# EAGLE design OSO-BILI-A1-00 (EAGLE 9.4.2)
COMPANY: ADAFRUIT INDUSTRIES; DRAWN: KTOWN; REV: B
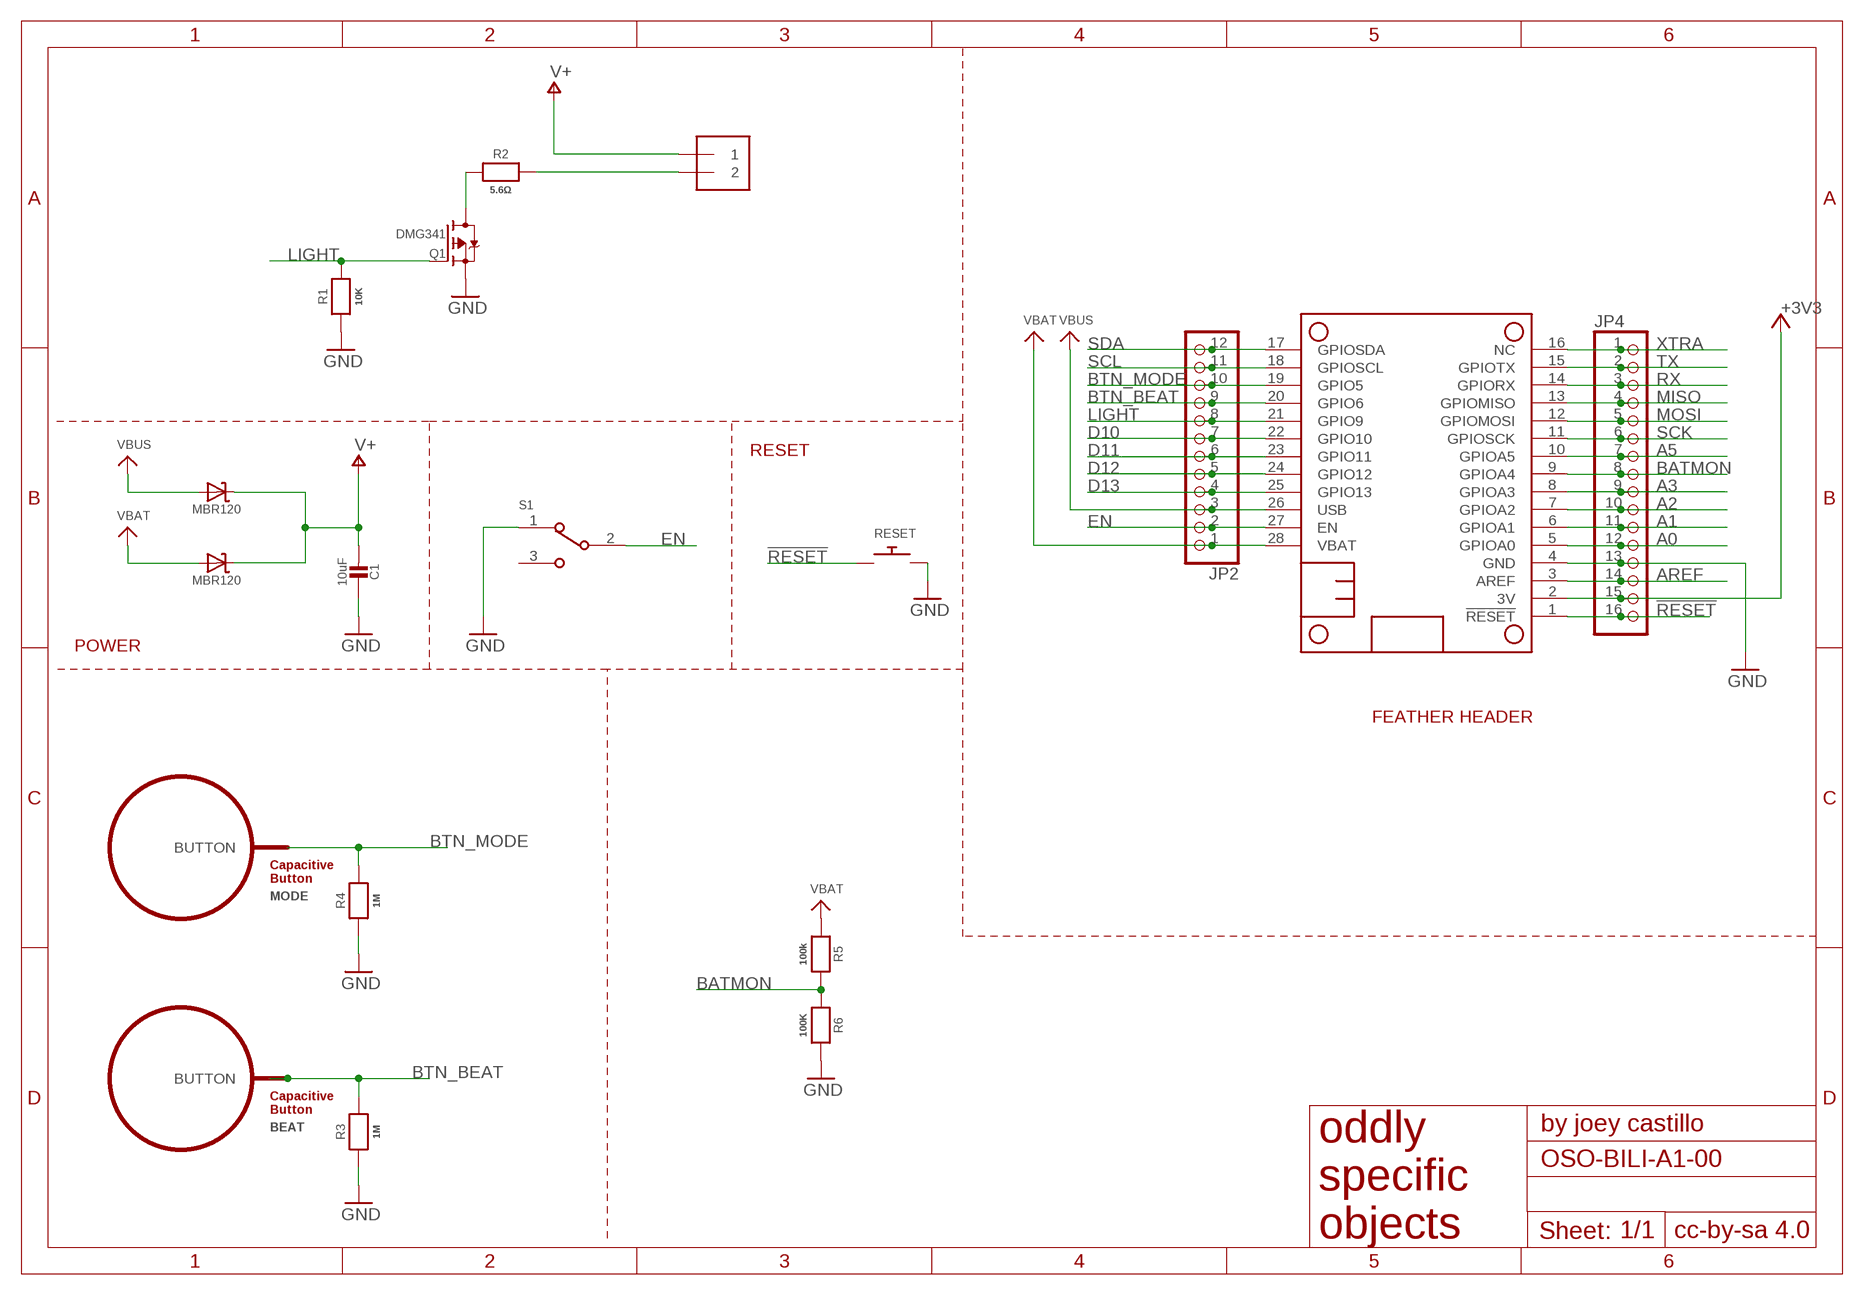
[diagram p0: schematic, sheet 1]

## Parts
BEAT  BUTTON_PASSIVE12MM  [BUTTON_PASSIVE_12MM]
C1  10uF  CAP_CERAMIC0805-NOOUTLINE  [0805-NO]
D1  MBR120  DIODE-SCHOTTKYSOD-123  [SOD-123]
D2  MBR120  DIODE-SCHOTTKYSOD-123  [SOD-123]
J1  1X25MM  [1X2-5MM]
JP2  HEADER-1X12  [1X12_ROUND]
JP4  HEADER-1X16ROUND  [1X16_ROUND]
MODE  BUTTON_PASSIVE8MM  [BUTTON_PASSIVE_8MM]
MS1  FEATHERWING  [FEATHERWING]
Q1  DMG341  MOSFET-P  [SOT23-R]
R1  10K  RESISTOR0805_NOOUTLINE  [0805-NO]
R2  5.6Ω  RESISTOR2012  [2012]
R3  1M  RESISTOR0805_NOOUTLINE  [0805-NO]
R4  1M  RESISTOR0805_NOOUTLINE  [0805-NO]
R5  100k  RESISTOR0805_10MGAP  [0805_10MGAP]
R6  100K  RESISTOR0805_NOOUTLINE  [0805-NO]
RESET  SWITCH_PUSHBUTTONC&K_KSS  [BTN_CK_KSS]
S1  JS102011SAQN  [SW_JS102011SAQN]

## Nets
3V [power]: JP4.15 MS1.2(3V) ; supply symbol labelled +3V3
!RESET: JP4.16 MS1.1(!RESET) RESET.P$1
A0: JP4.12 MS1.5(GPIOA0)
A1: JP4.11 MS1.6(GPIOA1)
A2: JP4.10 MS1.7(GPIOA2)
A3: JP4.9 MS1.8(GPIOA3)
A5: JP4.7 MS1.10(GPIOA5)
AREF: JP4.14 MS1.3(AREF)
BATMON: JP4.8 MS1.9(GPIOA4) R5.2 R6.1
BTN_BEAT: BEAT.BUTTON JP2.9 MS1.20(GPIO6) R3.2
BTN_MODE: JP2.10 MODE.BUTTON MS1.19(GPIO5) R4.2
D10: JP2.7 MS1.22(GPIO10)
D11: JP2.6 MS1.23(GPIO11)
D12: JP2.5 MS1.24(GPIO12)
D13: JP2.4 MS1.25(GPIO13)
EN: JP2.2 MS1.27(EN) S1.2
GND [gnd]: C1.1 JP4.13 MS1.4(GND) Q1.2(S) R1.1 R3.1 R4.1 R6.2 RESET.P$2 S1.1
LIGHT: JP2.8 MS1.21(GPIO9) Q1.1(G) R1.2
MISO: JP4.4 MS1.13(GPIOMISO)
MOSI: JP4.5 MS1.12(GPIOMOSI)
N$1: Q1.3(D) R2.1
N$2: J1.2 R2.2
RX: JP4.3 MS1.14(GPIORX)
SCK: JP4.6 MS1.11(GPIOSCK)
SCL: JP2.11 MS1.18(GPIOSCL)
SDA: JP2.12 MS1.17(GPIOSDA)
TX: JP4.2 MS1.15(GPIOTX)
V+: C1.2 D1.C D2.C J1.1
VBAT [power]: D2.A JP2.1 MS1.28(VBAT) R5.1
VBUS [power]: D1.A JP2.3 MS1.26(USB)
XTRA: JP4.1 MS1.16(NC)
Unconnected: S1.3

## Notes on the sheet
- RESET
- POWER
- FEATHER HEADER

## Library data of the parts
BEAT MODE = My Stuff:BUTTON_PASSIVE: Button, Passive Capacitive/Touch Sensing Type Source : http://www.PatternAgents.com Github : https://github.com/PatternAgents License : http://creativecommons.org/licenses/by-sa/3.1/ (Creative Commons 3.1) THIS SOFTWARE IS PROVIDED BY THE CONTRIBUTORS "AS IS" AND WITHOUT ANY EXPRESS OR IMPLIED WARRANTIES, INCLUDING, BUT NOT LIMITED TO, THE IMPLIED WARRANTIES OF MERCHANTABILITY AND FITNESS FOR A PARTICULAR PURPOSE ARE DISCLAIMED. IN NO EVENT SHALL THE COPYRIGHT OWNER OR CONTRIBUTORS BE LIABLE FOR ANY DIRECT, INDIRECT, INCIDENTAL, SPECIAL, EXEMPLARY, OR CONSEQUENTIAL DAMAGES (INCLUDING, BUT NOT LIMITED TO, PROCUREMENT OF SUBSTITUTE GOODS OR SERVICES; LOSS OF USE, DATA, OR PROFITS; OR BUSINESS INTERRUPTION) HOWEVER CAUSED AND ON ANY THEORY OF LIABILITY, WHETHER IN CONTRACT, STRICT LIABILITY, OR TORT (INCLUDING NEGLIGENCE OR OTHERWISE) ARISING IN ANY WAY OUT OF THE USE OF THIS SOFTWARE, EVEN IF ADVISED OF THE POSSIBILITY OF SUCH DAMAGE.
C1 = microbuilder:CAP_CERAMIC: Ceramic Capacitors For new designs, use the packages preceded by an '_' character since they are more reliable: The following footprints should be used on most boards: _0402 - Standard footprint for regular board layouts _0603 - Standard footprint for regular board layouts _0805 - Standard footprint for regular board layouts _1206 - Standard footprint for regular board layouts For extremely tight-pitch boards where space is at a premium, the following 'micro-pitch' footprints can be used (smaller pads, no silkscreen outline, etc.): _0402MP - Micro-pitch footprint for very dense/compact boards _0603MP - Micro-pitch footprint for very dense/compact boards _0805MP - Micro-pitch footprint for very dense/compact boards _1206MP - Micro-pitch footprint for very dense/compact boards
D1 D2 = microbuilder:DIODE-SCHOTTKY
J1 = My Stuff:1X2: 3.5mm Terminal block http://www.ladyada.net/library/pcb/eaglelibrary.html
JP2 = microbuilder:HEADER-1X12
JP4 = microbuilder:HEADER-1X16: PIN HEADER
MS1 = adafruit:FEATHERWING
Q1 = microbuilder:MOSFET-P: P-Channel Mosfet LEGEND VDS: Voltage Drain-Source ID: Drain Current RDS(ON): Drain-Source On-State Resistance VGS(TH): Gate-Source Threshold Voltage CISS: Drain-Source Input Capacitance SOT-23 Name VDS ID RDS(ON) VGS(TH) CISS Order Number IRLML5103 30V 760mA 600 mOhm -- 75pF @ 25V Digikey: IRLML5103PBFCT-ND IRLML6401 12V 4.3A 50 mOhm 950mV @ 250µA 830pF @ 10V Digikey: IRLML6401PBFTR-ND NTR0202PL 20V 400mA 800 mOhm 2.3V @ 250uA 70pF @ 5V Digikey: NTR0202PLT1GOSTR-ND NTR4101PT1G 20V 1.8A 85 mOhm 1.2V @ 250uA 675pF @ 10V Digikey: NTR4101PT1GOSCT-ND DMP2004K 20V 600mA 900 mOhm 1V @ 250uA 175pF @ 16V Digikey: DMP2004KDICT-ND PMV65XP 20V 3.9A 76 mOhm 950mV @ 1mA 725pF @ 20V Digikey: 568-2358-2-ND TO-252 Name VDS ID RDS(ON) VGS(TH) CISS Order Number AOD417 30V 25A 34 mOhm 3V @ 250µA 920pF @ 15V Digikey: 785-1106-2-ND PowerPak Name VDS ID RDS(ON) VGS(TH) CISS Order Number AON7401 30V 12A 14 mOhm 3V @ 250µA 2600pF @ 15V Digikey: 785-1302-1-ND
R1-R6 = microbuilder:RESISTOR: Resistors For new designs, use the packages preceded by an '_' character since they are more reliable: The following footprints should be used on most boards: _0402 - Standard footprint for regular board layouts _0603 - Standard footprint for regular board layouts _0805 - Standard footprint for regular board layouts _1206 - Standard footprint for regular board layouts For extremely tight-pitch boards where space is at a premium, the following 'micro-pitch' footprints can be used (smaller pads, no silkscreen outline, etc.): _0402MP - Micro-pitch footprint for very dense/compact boards _0603MP - Micro-pitch footprint for very dense/compact boards _0805MP - Micro-pitch footprint for very dense/compact boards _1206MP - Micro-pitch footprint for very dense/compact boards
RESET = adafruit:SWITCH_PUSHBUTTON: Buttons SOFTTOUCHSMD_SJ - Soft touch temporary push button (Super Junk Akihabara) Compatible with SKPMANE010 [Mouser: 688-SKPMAN] C&K_KSS = Digikey: KSS221GLFS
S1 = JS102011SAQN:JS102011SAQN: JS10 Series SPDT On-On 6 V 0.3 A Gull Wing SMT Slide Switch http://www.snapeda.com/parts/JS102011SAQN/C%26K%20Components/view-part/; DESCRIPTION: Slide Switch SPDT Surface Mount, Right Angle; DIGI-KEY_PART_NUMBER: 401-1999-1-ND; DIGI-KEY_PURCHASE_URL: https://www.digikey.com/product-detail/en/c-k/JS102011SAQN/401-1999-1-ND/1640114?utm_source=snapeda&utm_medium=aggregator&utm_campaign=symbol; MF: C&K; MP: JS102011SAQN; PACKAGE: None

## Net classes
0 default: width 0.152 mm, drill 0.254 mm
1 power: width 0.305 mm, drill 0.305 mm

## Board
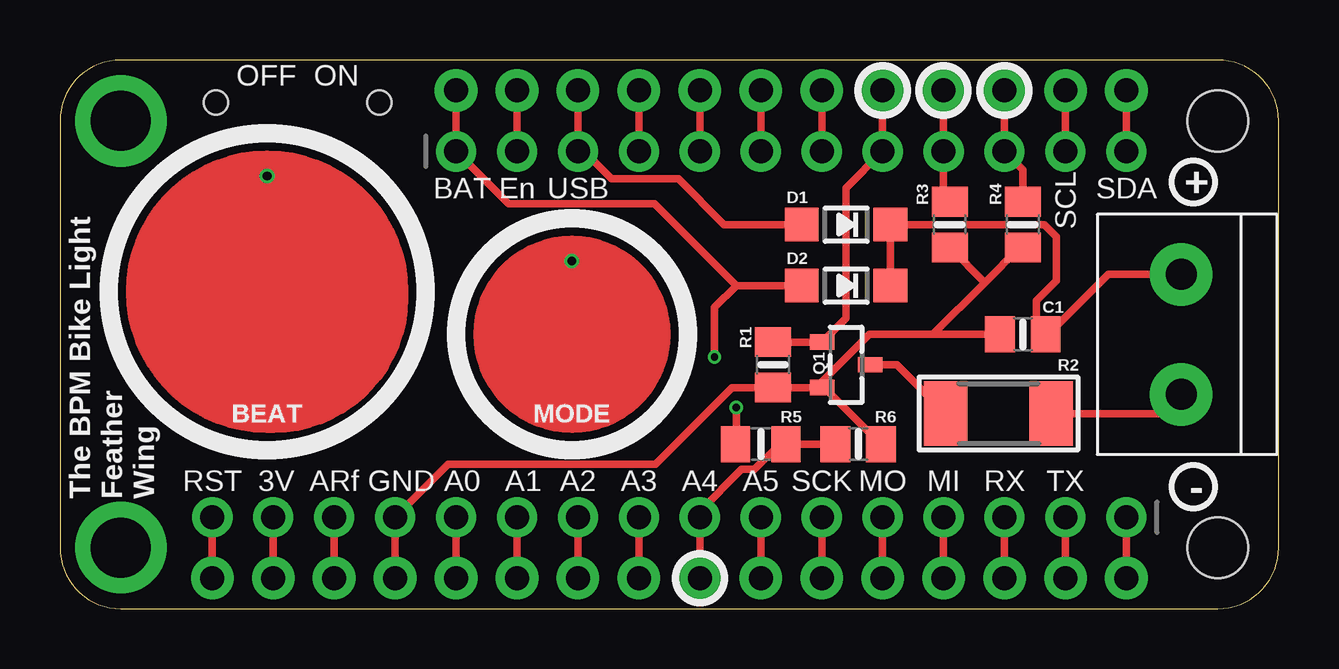
[diagram p1: board, top side]
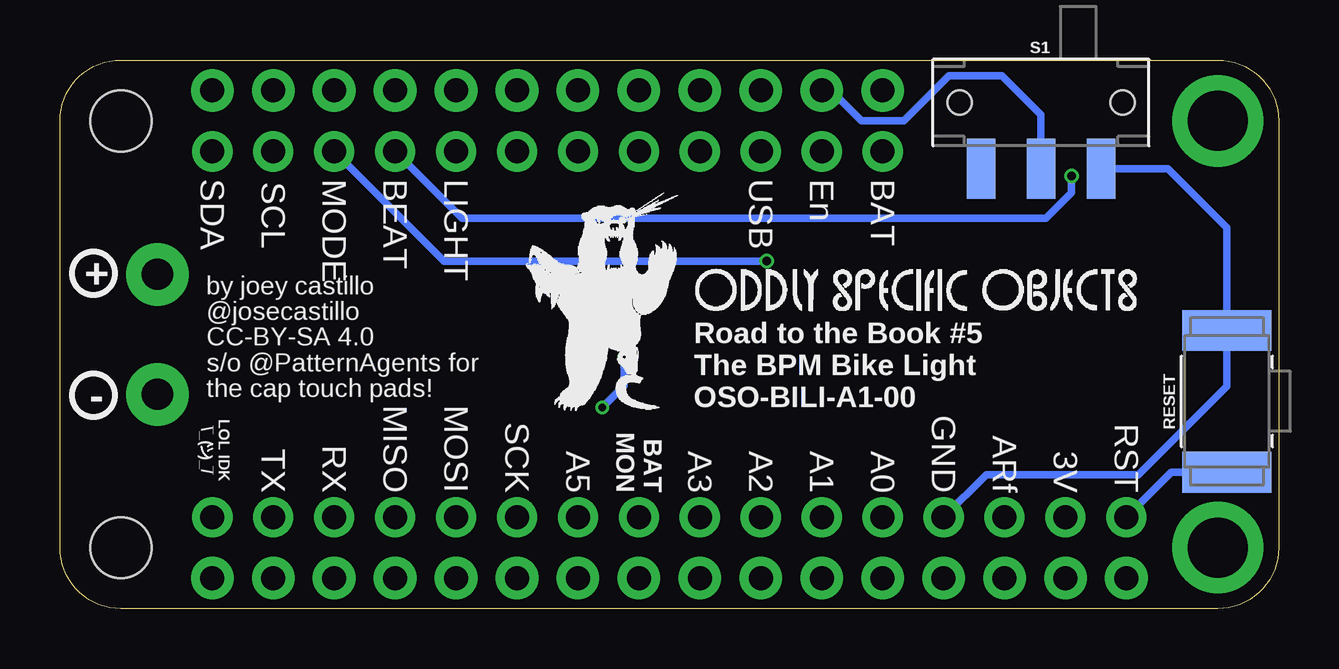
[diagram p2: board, bottom side, seen from below]

Size 50.8 x 22.86 mm. Coordinates in mm from the lower left corner, seen from the top.
Outline: 2.54,0 48.26,0 arc90 50.8,2.54 50.8,20.32 arc90 48.26,22.86 2.54,22.86 arc90 0,20.32 0,2.54 arc90 2.54,0
Copper layers (1*16): Top 0.035559375mm / dielectric 1.6mm / Bottom 0.035559375mm
Design rules "oshpark-2layer *": minimum track width 6mil, minimum drill 10mil, track to track 6mil, track to pad 6mil, pad to pad 6mil, via to via 6mil, smd to smd 6mil, copper to edge 15mil, drill to drill 6mil, minimum pad ring 5mil, minimum via ring 5mil, stop-mask expansion 2.5mil, vias tented up to drill 12mil, thermal gap 10mil

### Footprints (pad centres in the part's own frame; a part is rotated, then mirrored left to right if it is on the bottom)
BUTTON_PASSIVE_12MM = drill 0.356: BUTTON 0,4.826
0805-NO = smd 1.24 x 1.5: 1 -0.95,0; 2 0.95,0
SOD-123 = smd 1.4 x 1.4: A 1.85,0; C -1.85,0
1X2-5MM = drill 1.3 pad 2.6: 1 2.5,0; 2 -2.5,0
1X12_ROUND = drill 1 pad 1.676: 1 -13.97,0; 2 -11.43,0; 3 -8.89,0; 4 -6.35,0; 5 -3.81,0; 6 -1.27,0; 7 1.27,0; 8 3.81,0; 9 6.35,0; 10 8.89,0; 11 11.43,0; 12 13.97,0
1X16_ROUND = drill 1 pad 1.676: 1 -19.05,0; 2 -16.51,0; 3 -13.97,0; 4 -11.43,0; 5 -8.89,0; 6 -6.35,0; 7 -3.81,0; 8 -1.27,0; 9 1.27,0; 10 3.81,0; 11 6.35,0; 12 8.89,0; 13 11.43,0; 14 13.97,0; 15 16.51,0; 16 19.05,0
BUTTON_PASSIVE_8MM = drill 0.356: BUTTON 0,3.048
FEATHERWING = drill 1 pad 1.778: 1 6.35,1.27; 2 8.89,1.27; 3 11.43,1.27; 4 13.97,1.27; 5 16.51,1.27; 6 19.05,1.27; 7 21.59,1.27; 8 24.13,1.27; 9 26.67,1.27; 10 29.21,1.27; 11 31.75,1.27; 12 34.29,1.27; 13 36.83,1.27; 14 39.37,1.27; 15 41.91,1.27; 16 44.45,1.27; 17 44.45,21.59; 18 41.91,21.59; 19 39.37,21.59; 20 36.83,21.59; 21 34.29,21.59; 22 31.75,21.59; 23 29.21,21.59; 24 26.67,21.59; 25 24.13,21.59; 26 21.59,21.59; 27 19.05,21.59; 28 16.51,21.59 | drill 2.5 pad 3.81: P$1 2.54,20.32; P$2 2.54,2.54 | hole 2.54: 48.26,20.32; 48.26,2.54
SOT23-R = smd 0.635 x 1.016: 1 -0.95,-1; 2 0.95,-1; 3 0,1
2012 = smd 1.8 x 2.7: 1 -2.2,0; 2 2.2,0
0805_10MGAP = smd 1.2 x 1.5: 1 -1.05,0; 2 1.05,0
BTN_CK_KSS = smd 1.7 x 3.7: P$1 -2.95,0; P$2 2.95,0
SW_JS102011SAQN = smd 1.2 x 2.5: 1 -2.5,2.75; 2 0,2.75; 3 2.5,2.75 | hole 1: -3.4,0; 3.4,0

### Placement (x,y rotation side)
BEAT  8.64,13.21 0 top
C1  40.13,11.43 0 top
D1  32.77,16 180 top
D2  32.77,13.46 180 top
J1  46.74,11.43 90 top
JP2  30.48,19.05 0 top
JP4  25.4,3.81 180 top
MODE  21.34,11.43 0 top
MS1  0,0 0 top
Q1  32.77,10.16 270 top
R1  29.72,10.16 90 top
R2  39.12,8.13 0 top
R3  37.08,16 90 top
R4  40.13,16 90 top
R5  29.21,6.86 0 top
R6  33.27,6.86 0 top
RESET  2.16,8.64 90 bottom
S1  9.91,21.08 180 bottom
U$1  [OSO_BEAR_250X360MIL_1000DPI]  28.19,12.83 0 bottom
U$3  [OSO_WORDMARK_ONELINE_725MIL_1000DPI]  24.38,12.32 0 bottom

### Tracks (layer width: path | path; a pad name or v marks a point on that pad's centre or on a via)
3V
  Top 0.305: JP4.15 MS1.2
!RESET
  Top 0.305: MS1.1 JP4.16
  Bottom 0.305: RESET.P$1 4.47,5.69 JP4.16
A0
  Top 0.305: JP4.12 MS1.5
A1
  Top 0.305: JP4.11 MS1.6
A2
  Top 0.305: JP4.10 MS1.7
A3
  Top 0.305: JP4.9 MS1.8
A5
  Top 0.305: JP4.7 MS1.10
AREF
  Top 0.305: MS1.3 JP4.14
BATMON
  Top 0.305: R6.1 R5.2 30.01,6.86 28.95,5.8 28.41,5.8 26.67,4.06 JP4.8 MS1.9
BTN_BEAT
  Top 0.305: MS1.20 JP2.9 36.83,17.21 R3.2
  Bottom 0.305: BEAT.BUTTON 8.64,17.32 9.7,16.26 34.04,16.26 JP2.9
BTN_MODE
  Top 0.305: R4.2 40.13,18.29 JP2.10 MS1.19
  Bottom 0.305: JP2.10 34.8,14.48 MODE.BUTTON
D10
  Top 0.305: MS1.22 JP2.7
D11
  Top 0.305: MS1.23 JP2.6
D12
  Top 0.305: JP2.5 MS1.24
D13
  Top 0.305: MS1.25 JP2.4
EN
  Top 0.305: JP2.2 MS1.27
  Bottom 0.305: S1.2 9.91,20.57 11.53,22.2 13.74,22.2 15.62,20.32 17.4,20.32 18.67,21.59 MS1.27
GND
  Top 0.305: 38.55,13.59 R3.1 | R4.1 40.01,15.05 38.55,13.59 | Q1.2 31.77,9.46 33.73,11.43 36.39,11.43 | Q1.2 31.87,9.21 R6.2 | MS1.4 JP4.13 16.18,6.02 24.82,6.02 28.01,9.21 R1.1 Q1.2 | C1.1 36.39,11.43 | 38.55,13.59 36.39,11.43
  Bottom 0.305: JP4.13 12.19,5.59 5.84,5.59 2.16,9.27 RESET.P$2 2.16,15.88 4.62,18.33 S1.1
LIGHT
  Top 0.305: R1.2 Q1.1 32.77,12.11 32.77,17.53 JP2.8 MS1.21
MISO
  Top 0.305: JP4.4 MS1.13
MOSI
  Top 0.305: JP4.5 MS1.12
N$1
  Top 0.305: Q1.3 34.88,10.16 R2.1
N$2
  Top 0.305: J1.2 45.93,8.13 R2.2
RX
  Top 0.305: JP4.3 MS1.14
SCK
  Top 0.305: JP4.6 MS1.11
SCL
  Top 0.305: MS1.18 JP2.11
SDA
  Top 0.305: MS1.17 JP2.12
TX
  Top 0.305: JP4.2 MS1.15
V+
  Top 0.305: D2.C D1.C 41.02,16 41.53,15.49 41.53,13.65 40.7,12.83 40.7,11.81 C1.2 41.19,11.43 43.69,13.93 J1.1
VBAT  (via drill 0.3)
  Top 0.305: D2.A 28.19,13.46 | 28.19,13.46 24.79,16.87 18.69,16.87 JP2.1 MS1.28 | v28.19,8.38 28.19,6.89 R5.1 | v27.28,10.49 27.28,12.55 28.19,13.46
  Bottom 0.305: v28.19,8.38 27.28,9.3 v27.28,10.49
VBUS
  Top 0.305: D1.A 27.69,16 25.78,17.91 22.99,17.91 21.84,19.05 JP2.3 MS1.26
XTRA
  Top 0.305: JP4.1 MS1.16

### Text on the board
tPlace: OFF ON | BAT | En | USB | SDA | + | SCL | The BPM Bike Light / Feather / Wing | RST | 3V | ARf | GND | A0 | A1 | A2 | A3 | A4 | A5 | SCK | MO | MI | RX | TX | -
bPlace: BAT | En | USB | LIGHT | BEAT | MODE | SCL | SDA | by joey castillo / @josecastillo / CC-BY-SA 4.0 / s/o @PatternAgents for / the cap touch pads! | + | Road to the Book #5 / The BPM Bike Light / OSO-BILI-A1-00 | - | LOL IDK | _ _ | \\_( )_/ | RST | 3V | ARf | GND | A0 | A1 | A2 | A3 | BAT / MON | A5 | SCK | MOSI | MISO | RX | TX